# Altium schematic sheet [01] - COVER PAGE.SchDoc: COVER PAGE
size A3; DrawnBy: Le Viet Trong; SheetNumber: 1; SheetTotal: 5
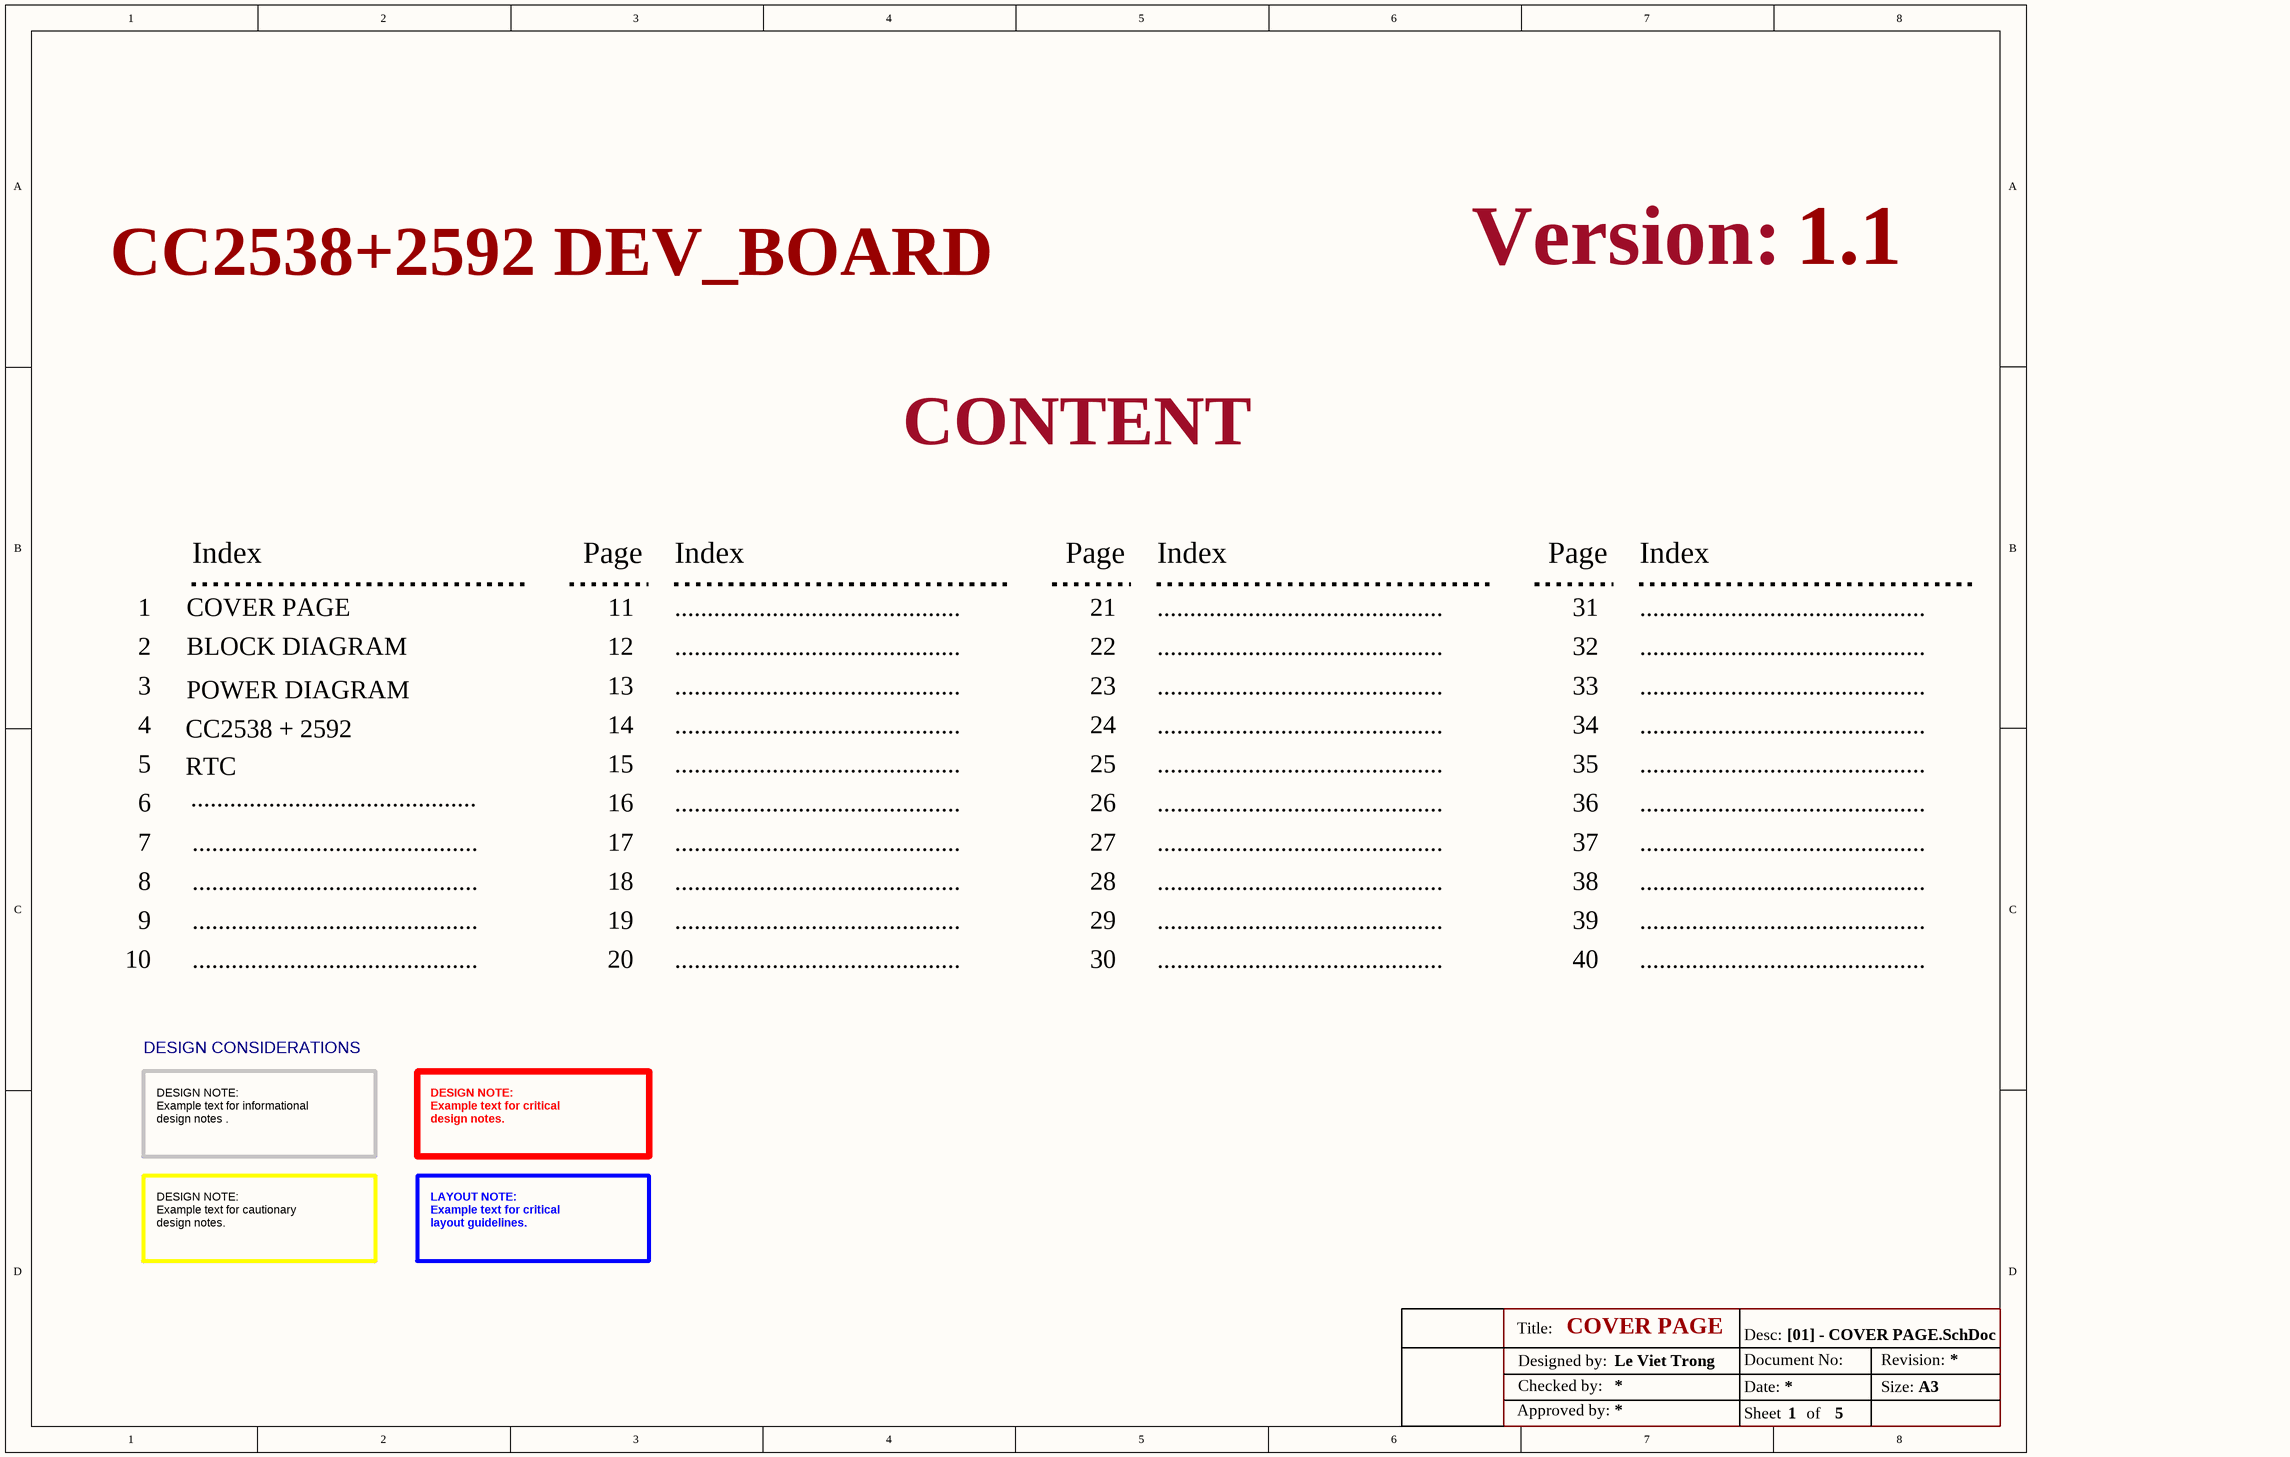
[diagram p0: [01] - COVER PAGE.SchDoc]

## Notes on the sheet
- CC2538+2592 DEV_BOARD
- Version:
- 1.1
- CONTENT
- Index
- Page
- 1
- COVER PAGE
- 11
- ............................................
- 21
- 31
- 2
- 3
- BLOCK DIAGRAM
- 12
- 13
- 22
- 23
- 32
- 33
- 4
- CC2538 + 2592
- POWER DIAGRAM
- 14
- 24
- 34
- 5
- 6
- RTC
- 15
- 16
- 25
- 26
- 35
- 36
- 7
- 8
- 17
- 18
- 27
- 28
- 37
- 38
- 9
- 19
- 29
- 39
- 10
- 20
- 30
- 40
- DESIGN CONSIDERATIONS
- DESIGN NOTE:
  Example text for informational
  design notes .
- DESIGN NOTE:
  Example text for critical
  design notes.
- DESIGN NOTE:
  Example text for cautionary
  design notes.
- LAYOUT NOTE:
  Example text for critical
  layout guidelines.
- Title:
- Desc:
- Designed by:
- Checked by:
- Date:
- Document No:
- Revision:
- Size:
- A3
- Approved by:
- Sheet
- of